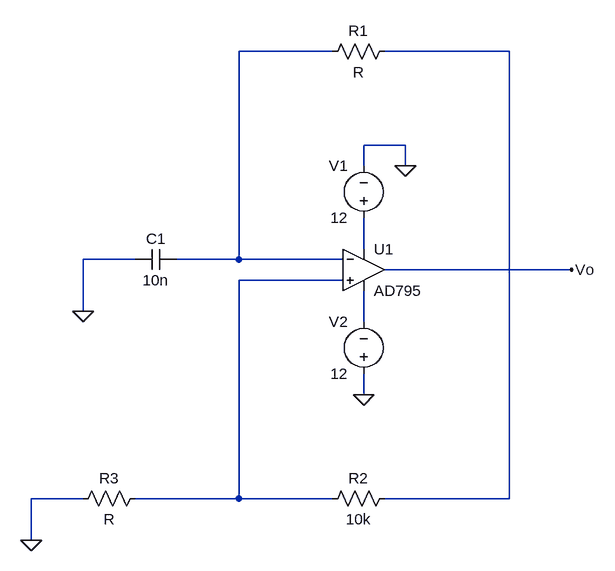
[diagram p0: schematic HW1_Q2.asc]
HW1_Q2.asc, the LTspice schematic file:
Version 4
SHEET 1 880 680
WIRE 208 -160 64 -160
WIRE 480 -160 288 -160
WIRE 320 -16 256 -16
WIRE 256 16 256 -16
WIRE 320 16 320 -16
WIRE 256 144 256 96
WIRE -96 160 -176 160
WIRE 64 160 64 -160
WIRE 64 160 -32 160
WIRE 224 160 64 160
WIRE 576 176 288 176
WIRE 224 192 64 192
WIRE -176 240 -176 160
WIRE 256 256 256 208
WIRE 256 368 256 336
WIRE -176 528 -256 528
WIRE 64 528 64 192
WIRE 64 528 -96 528
WIRE 208 528 64 528
WIRE 480 528 480 -160
WIRE 480 528 288 528
WIRE -256 592 -256 528
FLAG 320 16 0
FLAG 256 368 0
FLAG -176 240 0
FLAG -256 592 0
FLAG 576 176 Vo
SYMBOL OpAmps\\AD795 256 112 R0
SYMATTR InstName U1
SYMBOL voltage 256 112 R180
WINDOW 0 24 96 Left 2
WINDOW 3 24 16 Left 2
SYMATTR InstName V1
SYMATTR Value 12
SYMBOL voltage 256 352 R180
WINDOW 0 24 96 Left 2
WINDOW 3 24 16 Left 2
SYMATTR InstName V2
SYMATTR Value 12
SYMBOL res 304 -176 R90
WINDOW 0 0 56 VBottom 2
WINDOW 3 32 56 VTop 2
SYMATTR InstName R1
SYMBOL res 304 512 R90
WINDOW 0 0 56 VBottom 2
WINDOW 3 32 56 VTop 2
SYMATTR InstName R2
SYMATTR Value 10k
SYMBOL res -80 512 R90
WINDOW 0 0 56 VBottom 2
WINDOW 3 32 56 VTop 2
SYMATTR InstName R3
SYMBOL cap -32 144 R90
WINDOW 0 0 32 VBottom 2
WINDOW 3 32 32 VTop 2
SYMATTR InstName C1
SYMATTR Value 10n

The netlist it stands for:
* HW1_Q2.asc
XU1 N004 N001 N003 N005 Vo AD795  ; pins In+ In- V+ V- OUT
V1 N003 0 12
V2 0 N005 12
R1 N002 N001 R
R2 N002 N004 10k
R3 N004 0 R
C1 N001 0 10n
.lib ADI1.lib
.backanno
.end